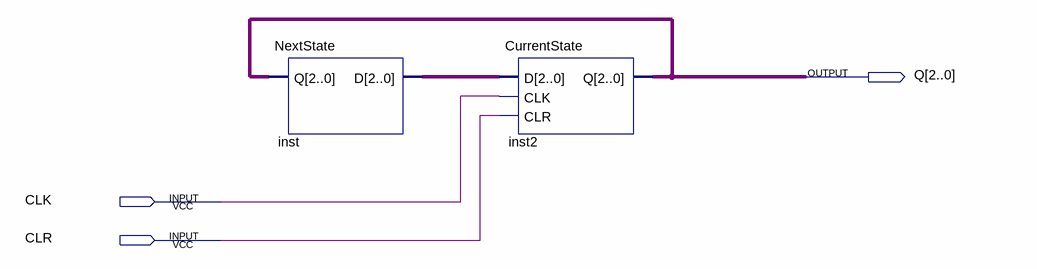
[diagram p0: schematic sheet]
// Quartus schematic FSM.bdf as structural Verilog: 2 symbols, 3 pins
module FSM (
  input  CLK,
  input  CLR,
  output [2:0] Q
);

  wire [2:0] inst_d;

  NextState inst (.Q(Q), .D(inst_d));
  CurrentState inst2 (.D(inst_d), .CLK(CLK), .CLR(CLR), .Q(Q));
endmodule
